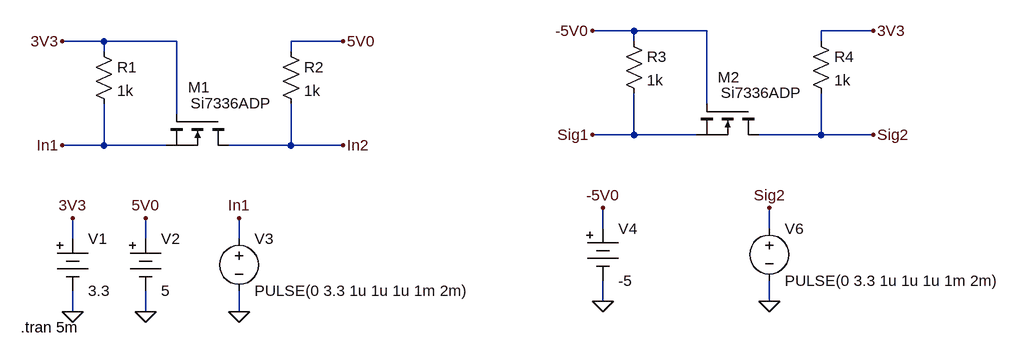
[diagram p0: schematic Level shifter simulation.asc]
Level shifter simulation.asc, the LTspice schematic file:
Version 4
SHEET 1 1400 680
WIRE 816 32 752 32
WIRE 928 32 816 32
WIRE 1184 32 1104 32
WIRE 0 48 -64 48
WIRE 112 48 0 48
WIRE 368 48 288 48
WIRE 816 48 816 32
WIRE 1104 48 1104 32
WIRE 0 64 0 48
WIRE 288 64 288 48
WIRE 928 144 928 32
WIRE 112 160 112 48
WIRE 816 192 816 128
WIRE 816 192 752 192
WIRE 912 192 816 192
WIRE 1104 192 1104 128
WIRE 1104 192 1008 192
WIRE 1184 192 1104 192
WIRE 0 208 0 144
WIRE 0 208 -64 208
WIRE 96 208 0 208
WIRE 288 208 288 144
WIRE 288 208 192 208
WIRE 368 208 288 208
WIRE 768 336 768 304
WIRE 1024 336 1024 304
WIRE -48 352 -48 320
WIRE 64 352 64 320
WIRE 208 352 208 320
WIRE 768 448 768 416
WIRE 1024 448 1024 416
WIRE -48 464 -48 432
WIRE 64 464 64 432
WIRE 208 464 208 432
FLAG -64 48 3V3
FLAG -64 208 In1
FLAG 368 208 In2
FLAG -48 464 0
FLAG 64 464 0
FLAG -48 320 3V3
FLAG 64 320 5V0
FLAG 208 464 0
FLAG 208 320 In1
FLAG 368 48 5V0
FLAG 752 32 -5V0
FLAG 752 192 Sig1
FLAG 1184 192 Sig2
FLAG 768 448 0
FLAG 768 304 -5V0
FLAG 1024 448 0
FLAG 1024 304 Sig2
FLAG 1184 32 3V3
SYMBOL nmos 192 160 R90
WINDOW 0 -41 29 VRight 2
WINDOW 3 -17 -65 VRight 2
SYMATTR InstName M1
SYMATTR Value Si7336ADP
SYMBOL res -16 48 R0
SYMATTR InstName R1
SYMATTR Value 1k
SYMBOL res 272 48 R0
SYMATTR InstName R2
SYMATTR Value 1k
SYMBOL Misc\\battery -48 336 R0
WINDOW 123 0 0 Left 0
WINDOW 39 0 0 Left 0
SYMATTR InstName V1
SYMATTR Value 3.3
SYMBOL Misc\\battery 64 336 R0
WINDOW 123 0 0 Left 0
WINDOW 39 0 0 Left 0
SYMATTR InstName V2
SYMATTR Value 5
SYMBOL voltage 208 336 R0
WINDOW 123 0 0 Left 0
WINDOW 39 0 0 Left 0
SYMATTR InstName V3
SYMATTR Value PULSE(0 3.3 1u 1u 1u 1m 2m)
SYMBOL nmos 1008 144 R90
WINDOW 0 -41 29 VRight 2
WINDOW 3 -17 -65 VRight 2
SYMATTR InstName M2
SYMATTR Value Si7336ADP
SYMBOL res 800 32 R0
SYMATTR InstName R3
SYMATTR Value 1k
SYMBOL res 1088 32 R0
SYMATTR InstName R4
SYMATTR Value 1k
SYMBOL Misc\\battery 768 320 R0
WINDOW 123 0 0 Left 0
WINDOW 39 0 0 Left 0
SYMATTR InstName V4
SYMATTR Value -5
SYMBOL voltage 1024 320 R0
WINDOW 123 0 0 Left 0
WINDOW 39 0 0 Left 0
SYMATTR InstName V6
SYMATTR Value PULSE(0 3.3 1u 1u 1u 1m 2m)
TEXT -128 488 Left 2 !.tran 5m

The netlist it stands for:
* Level shifter simulation.asc
M1 In2 3V3 In1 In1 Si7336ADP
R1 3V3 In1 1k
R2 5V0 In2 1k
V1 3V3 0 3.3
V2 5V0 0 5
V3 In1 0 PULSE(0 3.3 1u 1u 1u 1m 2m)
M2 Sig2 -5V0 Sig1 Sig1 Si7336ADP
R3 -5V0 Sig1 1k
R4 3V3 Sig2 1k
V4 -5V0 0 -5
V6 Sig2 0 PULSE(0 3.3 1u 1u 1u 1m 2m)
.model NMOS NMOS
.model PMOS PMOS
.lib standard.mos
.tran 5m
.backanno
.end